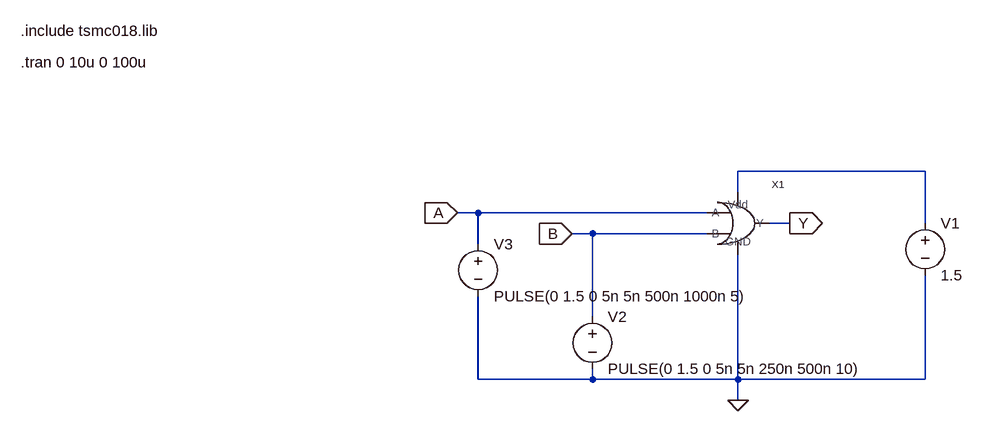
[diagram p0: schematic or_cmos_tb.asc]
or_cmos_tb.asc, the LTspice schematic file:
Version 4
SHEET 1 880 680
WIRE 528 128 240 128
WIRE 240 160 240 128
WIRE -160 192 -192 192
WIRE 192 192 -160 192
WIRE 320 208 288 208
WIRE 528 208 528 128
WIRE 16 224 -16 224
WIRE 192 224 16 224
WIRE -160 240 -160 192
WIRE 16 352 16 224
WIRE -160 448 -160 320
WIRE 16 448 16 432
WIRE 16 448 -160 448
WIRE 240 448 240 256
WIRE 240 448 16 448
WIRE 528 448 528 288
WIRE 528 448 240 448
WIRE 240 480 240 448
FLAG 240 480 0
FLAG 320 208 Y
IOPIN 320 208 Out
FLAG -192 192 A
IOPIN -192 192 In
FLAG -16 224 B
IOPIN -16 224 In
SYMBOL or_cmos 208 176 R0
SYMATTR InstName X1
SYMBOL voltage 528 192 R0
WINDOW 123 0 0 Left 0
WINDOW 39 0 0 Left 0
SYMATTR InstName V1
SYMATTR Value 1.5
SYMBOL voltage 16 336 R0
WINDOW 123 0 0 Left 0
WINDOW 39 0 0 Left 0
SYMATTR InstName V2
SYMATTR Value PULSE(0 1.5 0 5n 5n 250n 500n 10)
SYMBOL voltage -160 224 R0
WINDOW 123 0 0 Left 0
WINDOW 39 0 0 Left 0
SYMATTR InstName V3
SYMATTR Value PULSE(0 1.5 0 5n 5n 500n 1000n 5)
TEXT -864 -88 Left 2 !.include tsmc018.lib
TEXT -864 -40 Left 2 !.tran 0 10u 0 100u

The netlist it stands for:
* or_cmos_tb.asc
XX1 Y N001 0 A B or_cmos  ; pins Y Vdd GND A B
V1 N001 0 1.5
V2 B 0 PULSE(0 1.5 0 5n 5n 250n 500n 10)
V3 A 0 PULSE(0 1.5 0 5n 5n 500n 1000n 5)
.include tsmc018.lib
.tran 0 10u 0 100u
.backanno
.end